# Altium schematic sheet PIC_RS232.SchDoc
size A3; ApprovedBy: D. Grossman; CheckedBy: G. Engel; Author: Y. Yakov; CompanyName: LightSense; DrawnBy: Y. Yakov; Engineer: Y.Yakov; Organization: LightSense
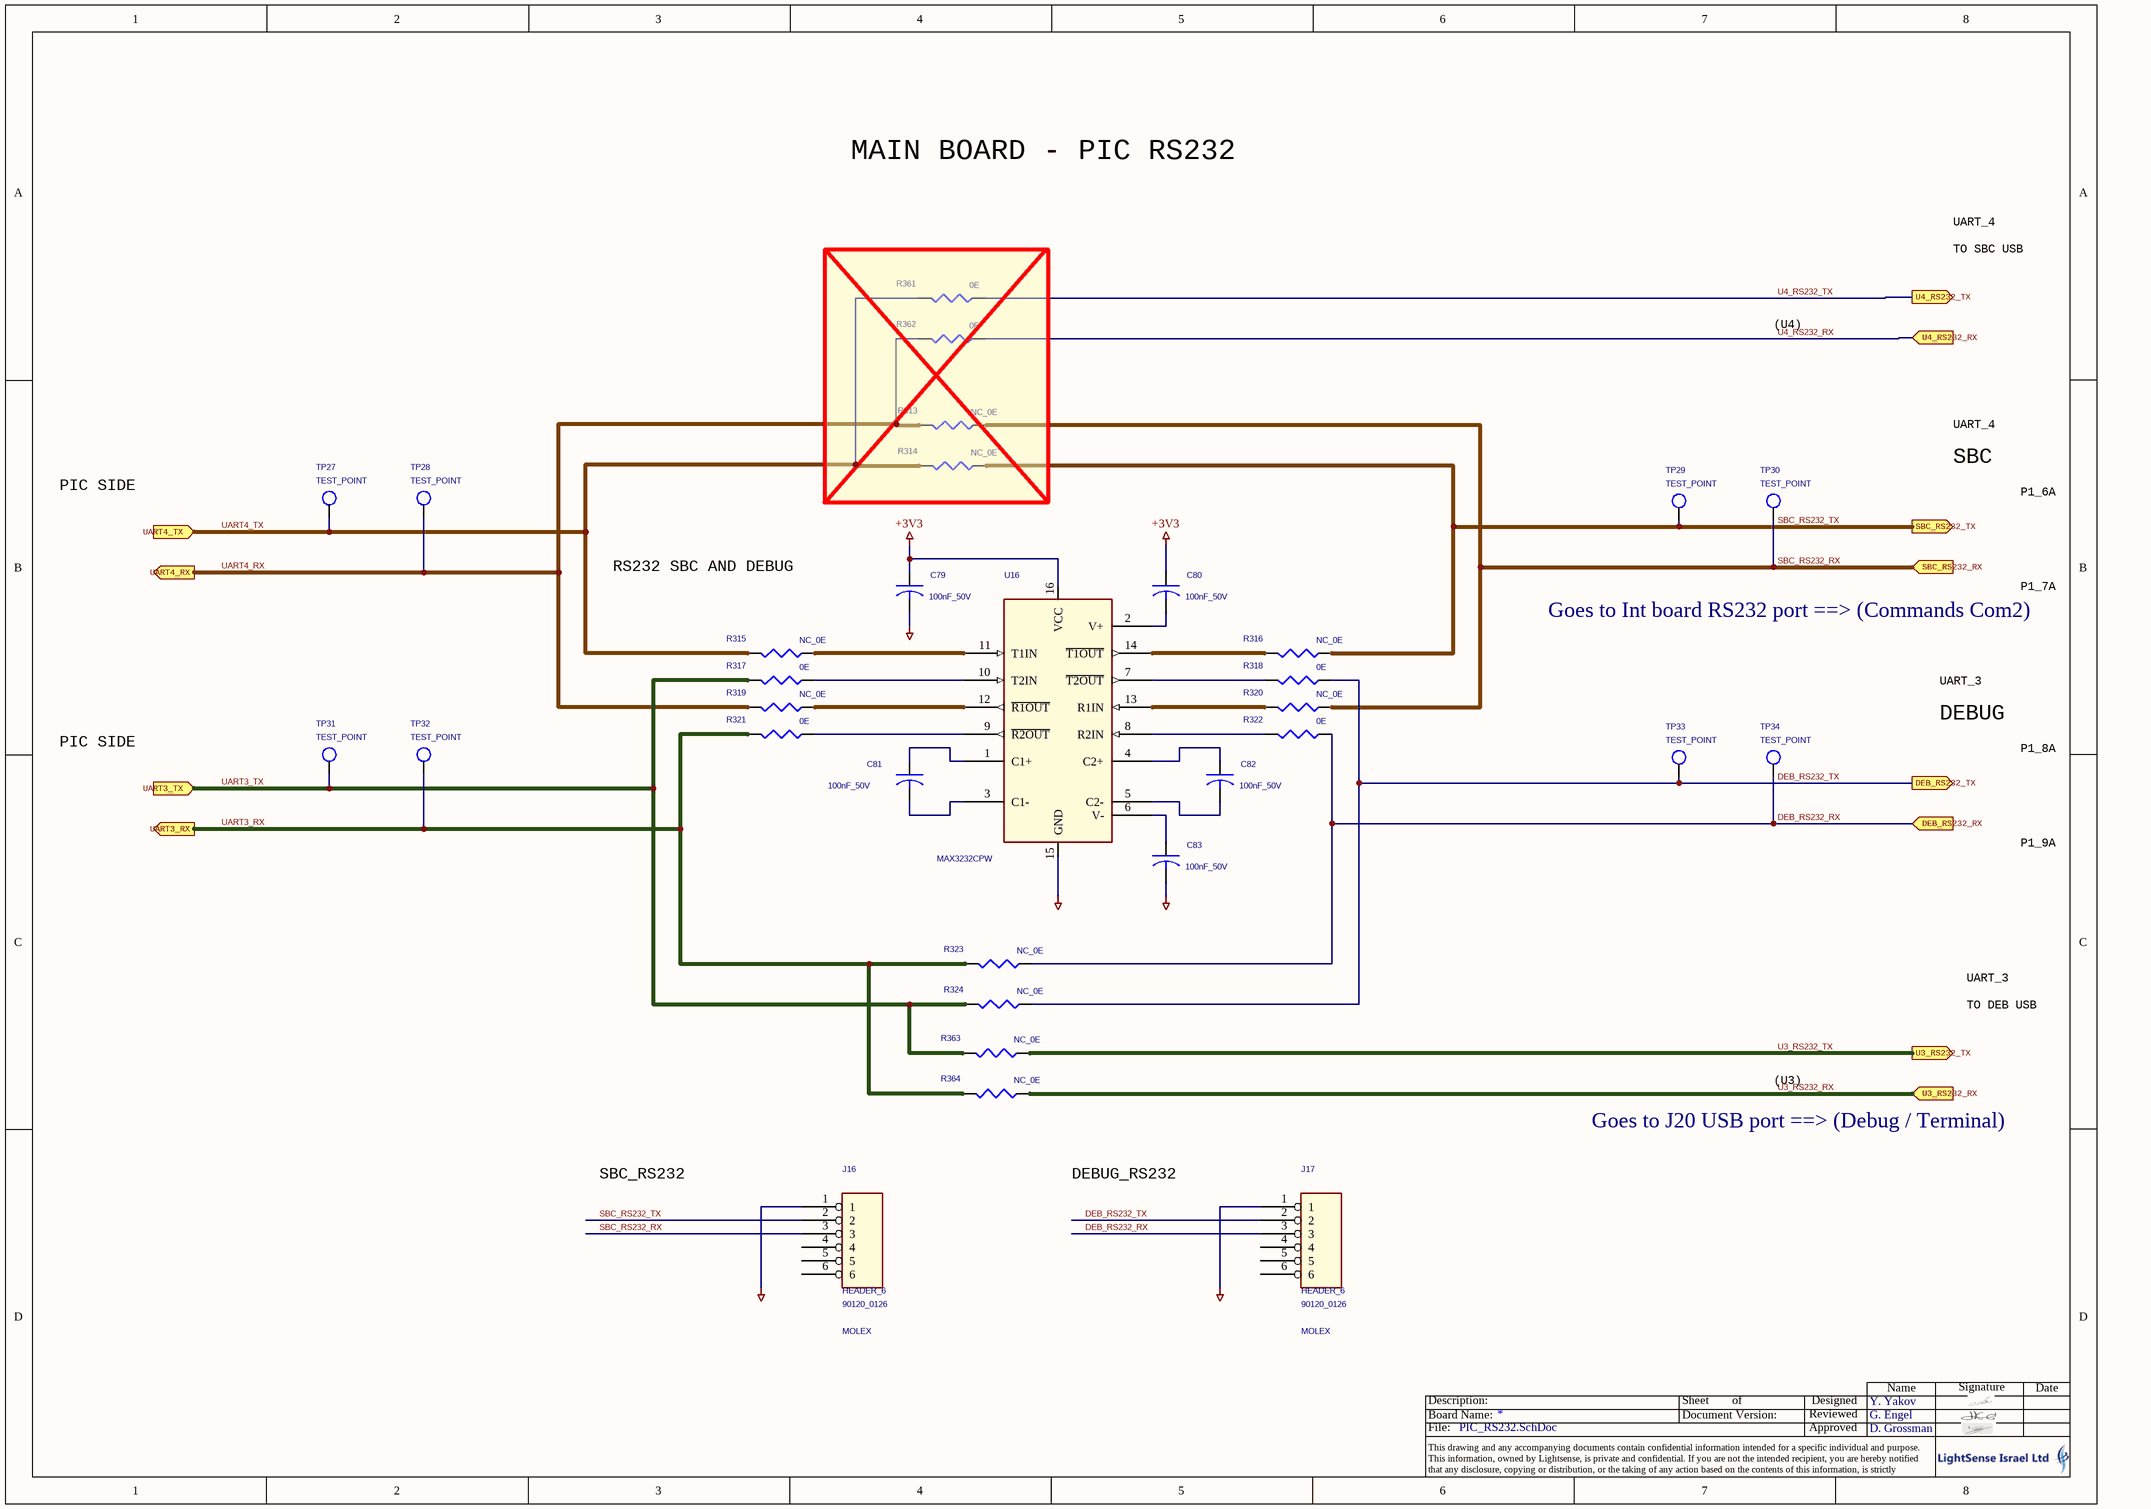
[diagram p0: PIC_RS232.SchDoc]

## Parts
C79  100nF_50V  [0603]
C80  100nF_50V  [0603]
C81  100nF_50V  [0603]
C82  100nF_50V  [0603]
C83  100nF_50V  [0603]
J16  HEADER_6  MFG: MOLEX  MFG_PN: 90120_0126  [HEADER_6PIN_100mil]
J17  HEADER_6  MFG: MOLEX  MFG_PN: 90120_0126  [HEADER_6PIN_100mil]
R313  NC_0E  [0603]
R314  NC_0E  [0603]
R315  NC_0E  [0603]
R316  NC_0E  [0603]
R317  0E  [0603]
R318  0E  [0603]
R319  NC_0E  [0603]
R320  NC_0E  [0603]
R321  0E  [0603]
R322  0E  [0603]
R323  NC_0E  [0603]
R324  NC_0E  [0603]
R361  0E  [0603]
R362  0E  [0603]
R363  NC_0E  [0603]
R364  NC_0E  [0603]
TP27  TEST_POINT  [TH_1mm]
TP28  TEST_POINT  [TH_1mm]
TP29  TEST_POINT  [TH_1mm]
TP30  TEST_POINT  [TH_1mm]
TP31  TEST_POINT  [TH_1mm]
TP32  TEST_POINT  [TH_1mm]
TP33  TEST_POINT  [TH_1mm]
TP34  TEST_POINT  [TH_1mm]
U16  MAX3232CPW  [TSSOP_16]

## Ports
DEB_RS232_RX (in), DEB_RS232_TX (out), SBC_RS232_RX (in), SBC_RS232_TX (out), U3_RS232_RX (in), U3_RS232_TX (out), U4_RS232_RX (in), U4_RS232_TX (out), UART3_RX (out), UART3_TX (in), UART4_RX (out), UART4_TX (in)

## Nets
+3V3: C79.1 C80.1 U16.16(VCC)
GND_CPU: C79.2 C83.2 J16.1 J17.1 U16.15(GND)
DEB_RS232_RX: J17.3 R322.1 R323.1 TP34.1(TP) ; port DEB_RS232_RX
DEB_RS232_TX: J17.2 R318.1 R324.1 TP33.1(TP) ; port DEB_RS232_TX
SBC_RS232_RX: J16.3 R313.1 R320.1 TP30.1(TP) ; port SBC_RS232_RX
SBC_RS232_TX: J16.2 R314.1 R316.1 TP29.1(TP) ; port SBC_RS232_TX
U3_RS232_RX: R364.1 ; port U3_RS232_RX
U3_RS232_TX: R363.1 ; port U3_RS232_TX
U4_RS232_RX: R362.1 ; port U4_RS232_RX
U4_RS232_TX: R361.1 ; port U4_RS232_TX
UART3_RX: R321.2 R323.2 R364.2 TP32.1(TP) ; port UART3_RX
UART3_TX: R317.2 R324.2 R363.2 TP31.1(TP) ; port UART3_TX
UART4_RX: R313.2 R319.2 R362.2 TP28.1(TP) ; port UART4_RX
UART4_TX: R314.2 R315.2 R361.2 TP27.1(TP) ; port UART4_TX
NetC80_2: C80.2 U16.2(V+)
NetC81_1: C81.1 U16.1(C1+)
NetC81_2: C81.2 U16.3(C1-)
NetC82_1: C82.1 U16.4(C2+)
NetC82_2: C82.2 U16.5(C2-)
NetC83_1: C83.1 U16.6(V-)
NetR315_1: R315.1 U16.11(T1IN)
NetR316_2: R316.2 U16.14(~{T1OUT})
NetR317_1: R317.1 U16.10(T2IN)
NetR318_2: R318.2 U16.7(~{T2OUT})
NetR319_1: R319.1 U16.12(~{R1OUT})
NetR320_2: R320.2 U16.13(R1IN)
NetR321_1: R321.1 U16.9(~{R2OUT})
NetR322_2: R322.2 U16.8(R2IN)

Not connected (* = marked no-connect by the designer): J16 4 5 6; J17 4 5 6

## Notes on the sheet
- MAIN BOARD - PIC RS232
- UART_4
- TO SBC USB
- (U4)
- PIC SIDE
- SBC
- P1_6A
- RS232 SBC AND DEBUG
- Goes to Int board RS232 port ==> (Commands Com2)
- P1_7A
- DEBUG
- UART_3
- P1_8A
- P1_9A
- TO DEB USB
- (U3)
- SBC_RS232
- DEBUG_RS232
- Goes to J20 USB port ==> (Debug / Terminal)
- Name
- Signature
- Date
- File:
- Board Name:
- Description:
- Document Version:
- Sheet
- of
- Approved
- Reviewed
- Designed
- This drawing and any accompanying documents contain confidential information intended for a specific individual and purpose.
  This information, owned by Lightsense, is private and confidential. If you are not the intended recipient, you are hereby notified that any disclosure, copying or distribution, or the taking of any action based on the contents of this information, is strictly prohibited.

## Library data of the parts
C79 C81 C82 = C: CAP_SMT_0603_50V_X7R_10%; MFG_PN: C0603C104K5RAC; MFG: KEMET
C80 C83 = C: CAP_SMT_0603_50V_X7R_10%; MFG: KEMET; MFG_PN: C0603C104K5RAC
J16 J17 = HEADER 6
R313-R315 R320-R322 R324 R361 R362 = R_Dup1: MFG_PN: RC0603FR-070R00L; MFG: YAGEO
R316-R319 R323 R363 R364 = R_Dup1: MFG: YAGEO; MFG_PN: RC0603FR-070R00L
TP27-TP34 = T POINT R_Dup1
U16 = MAX3232ESE_0: MFG: TI; MFG_PN: MAX3232CPW